# EAGLE schematic potentiometers (EAGLE 7.2.0)
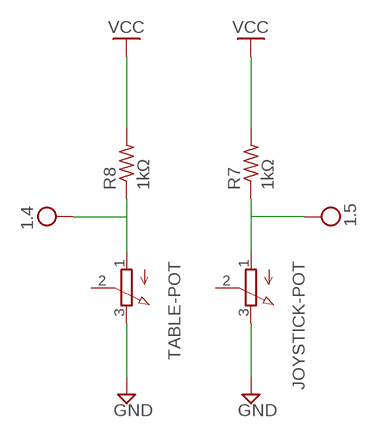
[diagram p0: schematic, sheet 1]

## Parts
JOYSTICK-POT  3RP/1610N  [3RP/1610N]
R7  1kΩ  R-US_0204/2V  [0204V]
R8  1kΩ  R-US_0204/2V  [0204V]
TABLE-POT  3RP/1610N  [3RP/1610N]

## Nets
GND: JOYSTICK-POT.3(E) R7.2 R8.2 TABLE-POT.3(E) ; supply symbol labelled VCC
N$17: R8.1 TABLE-POT.1(A)
N$18: JOYSTICK-POT.1(A) R7.1
Unconnected: JOYSTICK-POT.2(S) TABLE-POT.2(S)

## Library data of the parts
JOYSTICK-POT TABLE-POT = pot:3RP/1610N: 16mm Potentiometer one level Source: http://www.alphapotentiometers.net/html/16mm_pot_2.html
R7 R8 = rcl:R-US_: RESISTOR, American symbol